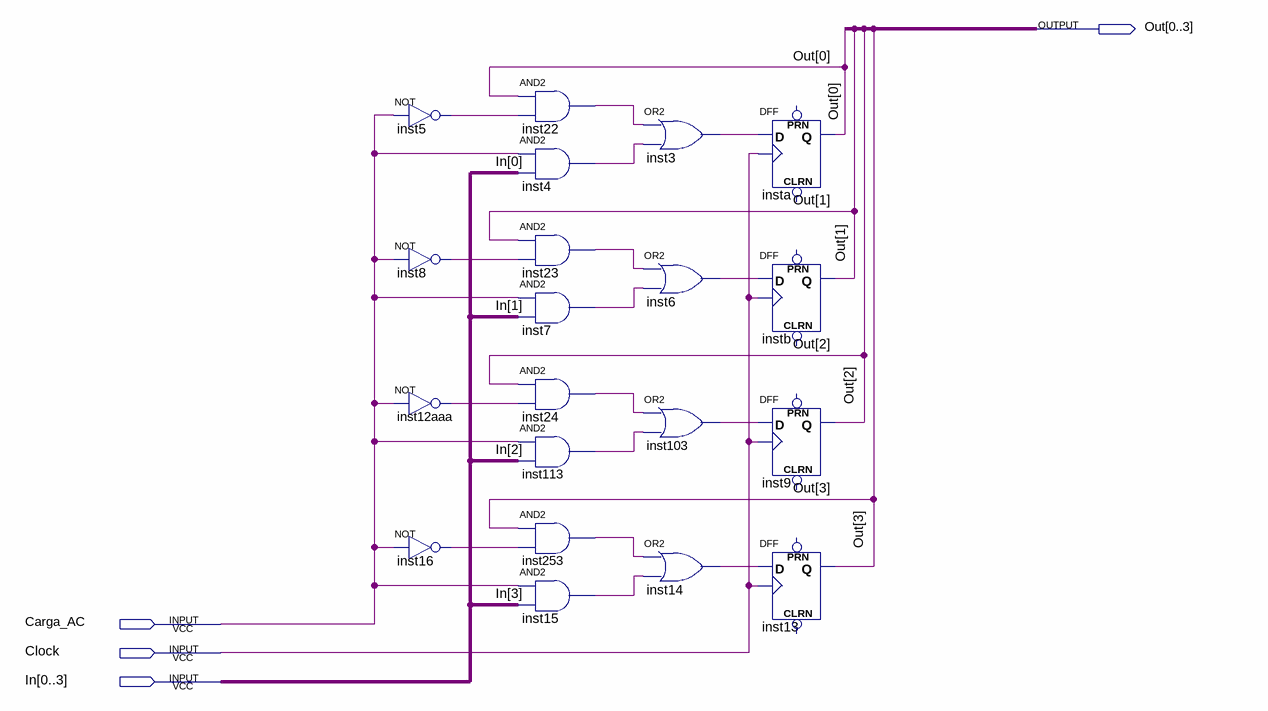
[diagram p0: schematic sheet]
// Quartus schematic AC.bdf as structural Verilog: 20 symbols, 4 pins
module AC (
  input  Carga_AC,
  input  Clock,
  input  [0:3] In,
  output [0:3] Out
);

  wire inst3_out, inst4_out, inst5_out, inst6_out, inst7_out, inst8_out, inst12aaa_out, inst14_out,
       inst15_out, inst16_out, inst22_out, inst23_out, inst24_out, inst103_out, inst113_out, inst253_out;

  not inst5 (inst5_out, Carga_AC);
  not inst8 (inst8_out, Carga_AC);
  not inst12aaa (inst12aaa_out, Carga_AC);
  not inst16 (inst16_out, Carga_AC);
  and inst22 (inst22_out, Out[0], inst5_out);
  and inst4 (inst4_out, Carga_AC, In[0]);
  and inst23 (inst23_out, Out[1], inst8_out);
  and inst7 (inst7_out, Carga_AC, In[1]);
  and inst24 (inst24_out, Out[2], inst12aaa_out);
  and inst113 (inst113_out, Carga_AC, In[2]);
  and inst253 (inst253_out, Out[3], inst16_out);
  and inst15 (inst15_out, Carga_AC, In[3]);
  or inst3 (inst3_out, inst22_out, inst4_out);
  or inst6 (inst6_out, inst23_out, inst7_out);
  or inst103 (inst103_out, inst24_out, inst113_out);
  or inst14 (inst14_out, inst253_out, inst15_out);
  DFF insta (.CLK(Clock), .D(inst3_out), .Q(Out[0]));  // open: CLRN, PRN
  DFF instb (.CLK(Clock), .D(inst6_out), .Q(Out[1]));  // open: CLRN, PRN
  DFF inst9 (.CLK(Clock), .D(inst103_out), .Q(Out[2]));  // open: CLRN, PRN
  DFF inst13 (.CLK(Clock), .D(inst14_out), .Q(Out[3]));  // open: CLRN, PRN
endmodule
